# EAGLE schematic Sensors_to_mcu_v0.1 (EAGLE 9.5.2)
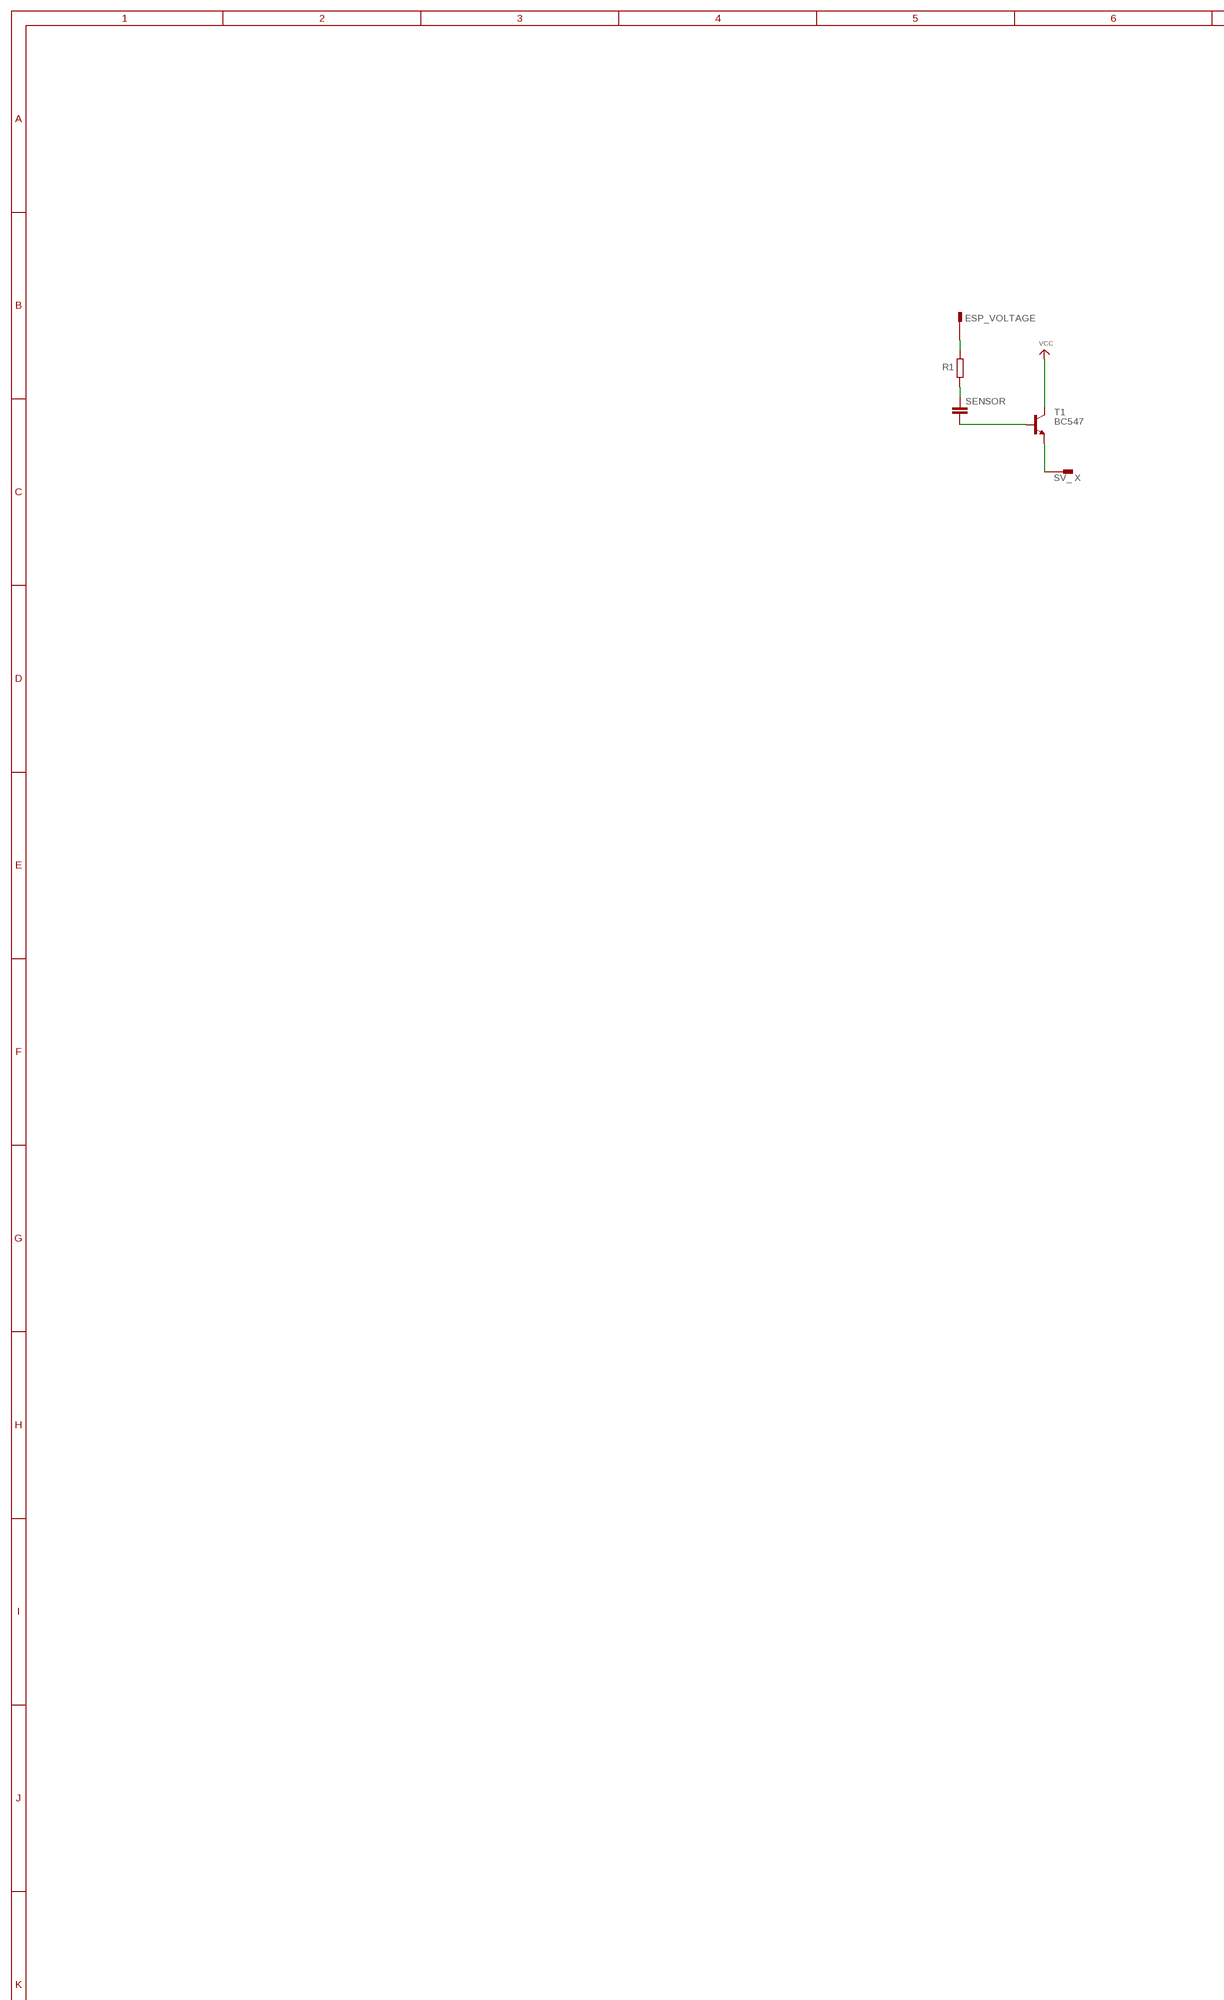
[diagram p0: schematic, sheet 1, part 1 of 3]
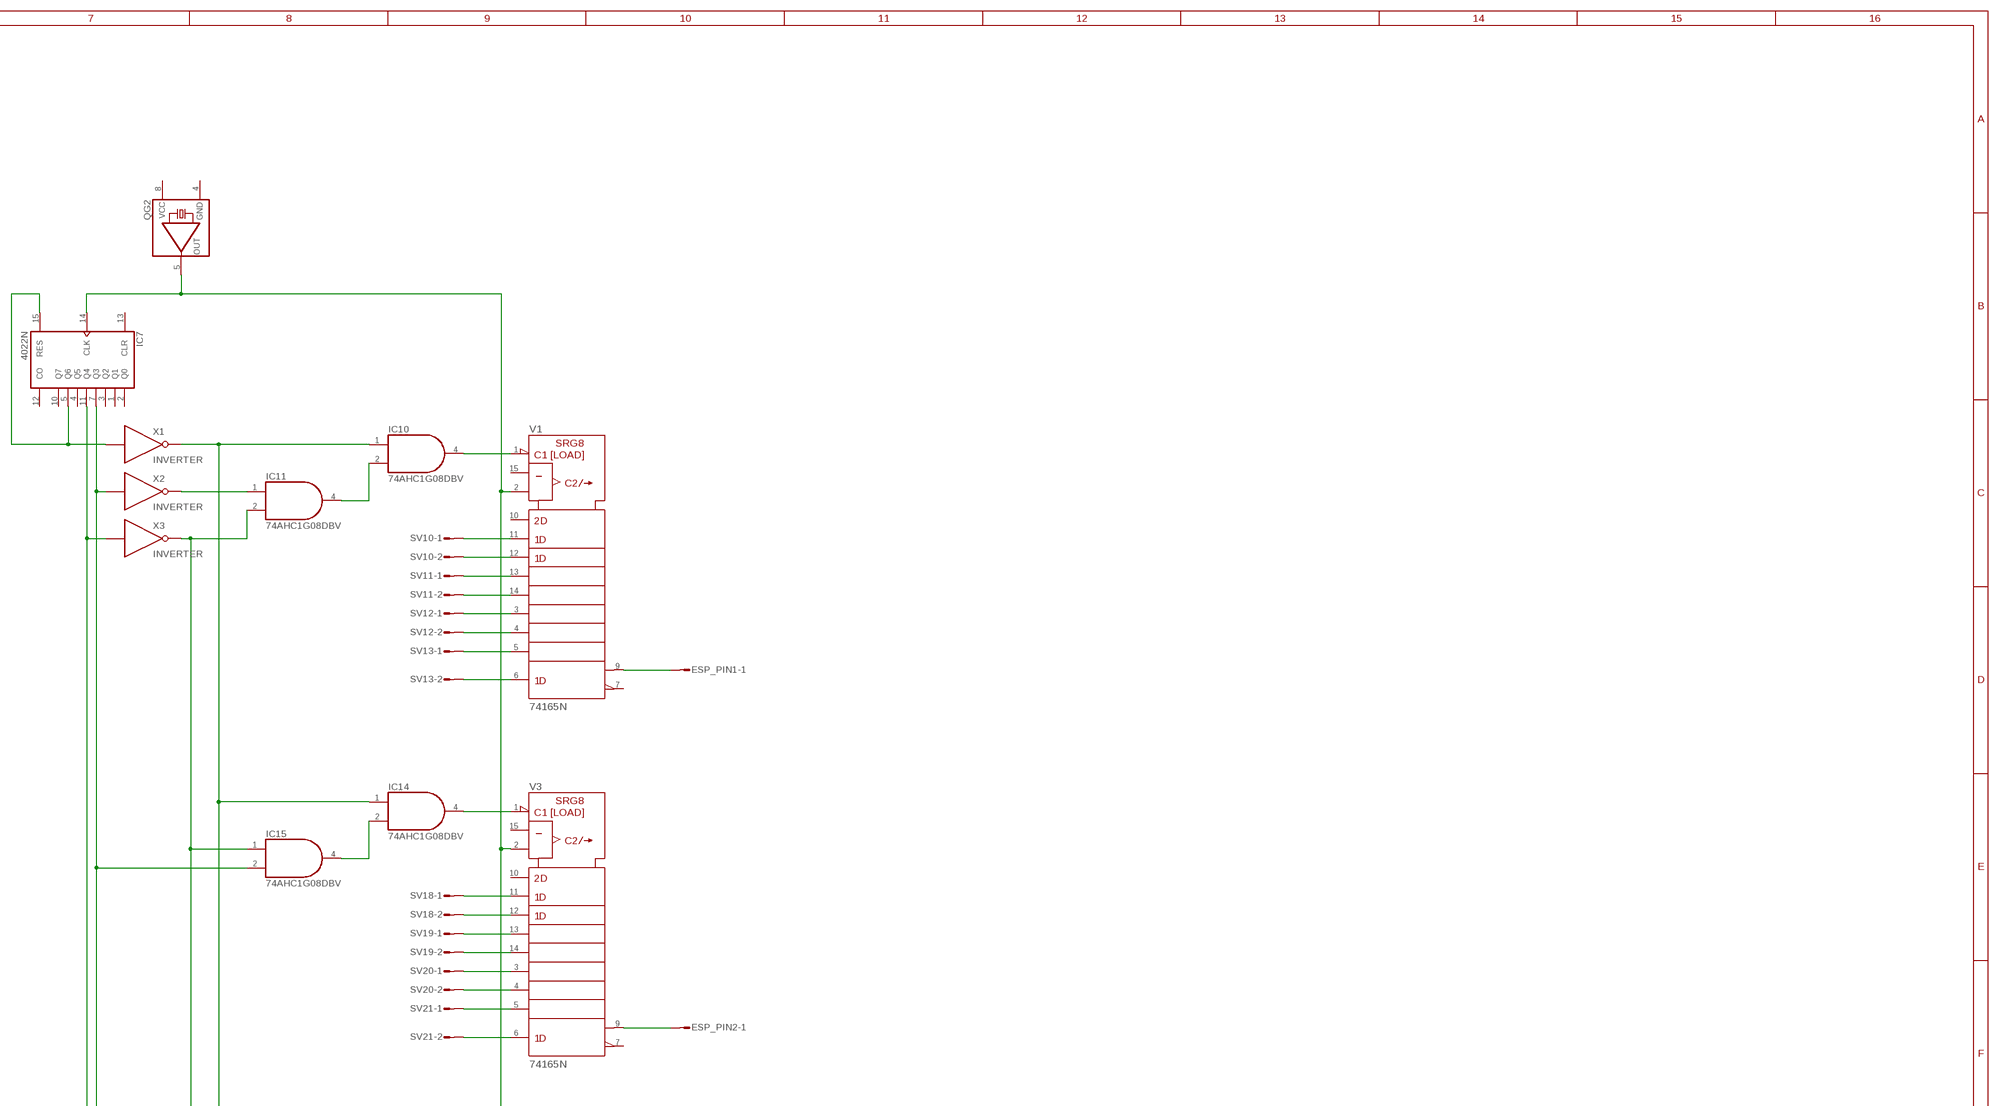
[diagram p1: schematic, sheet 1, part 2 of 3]
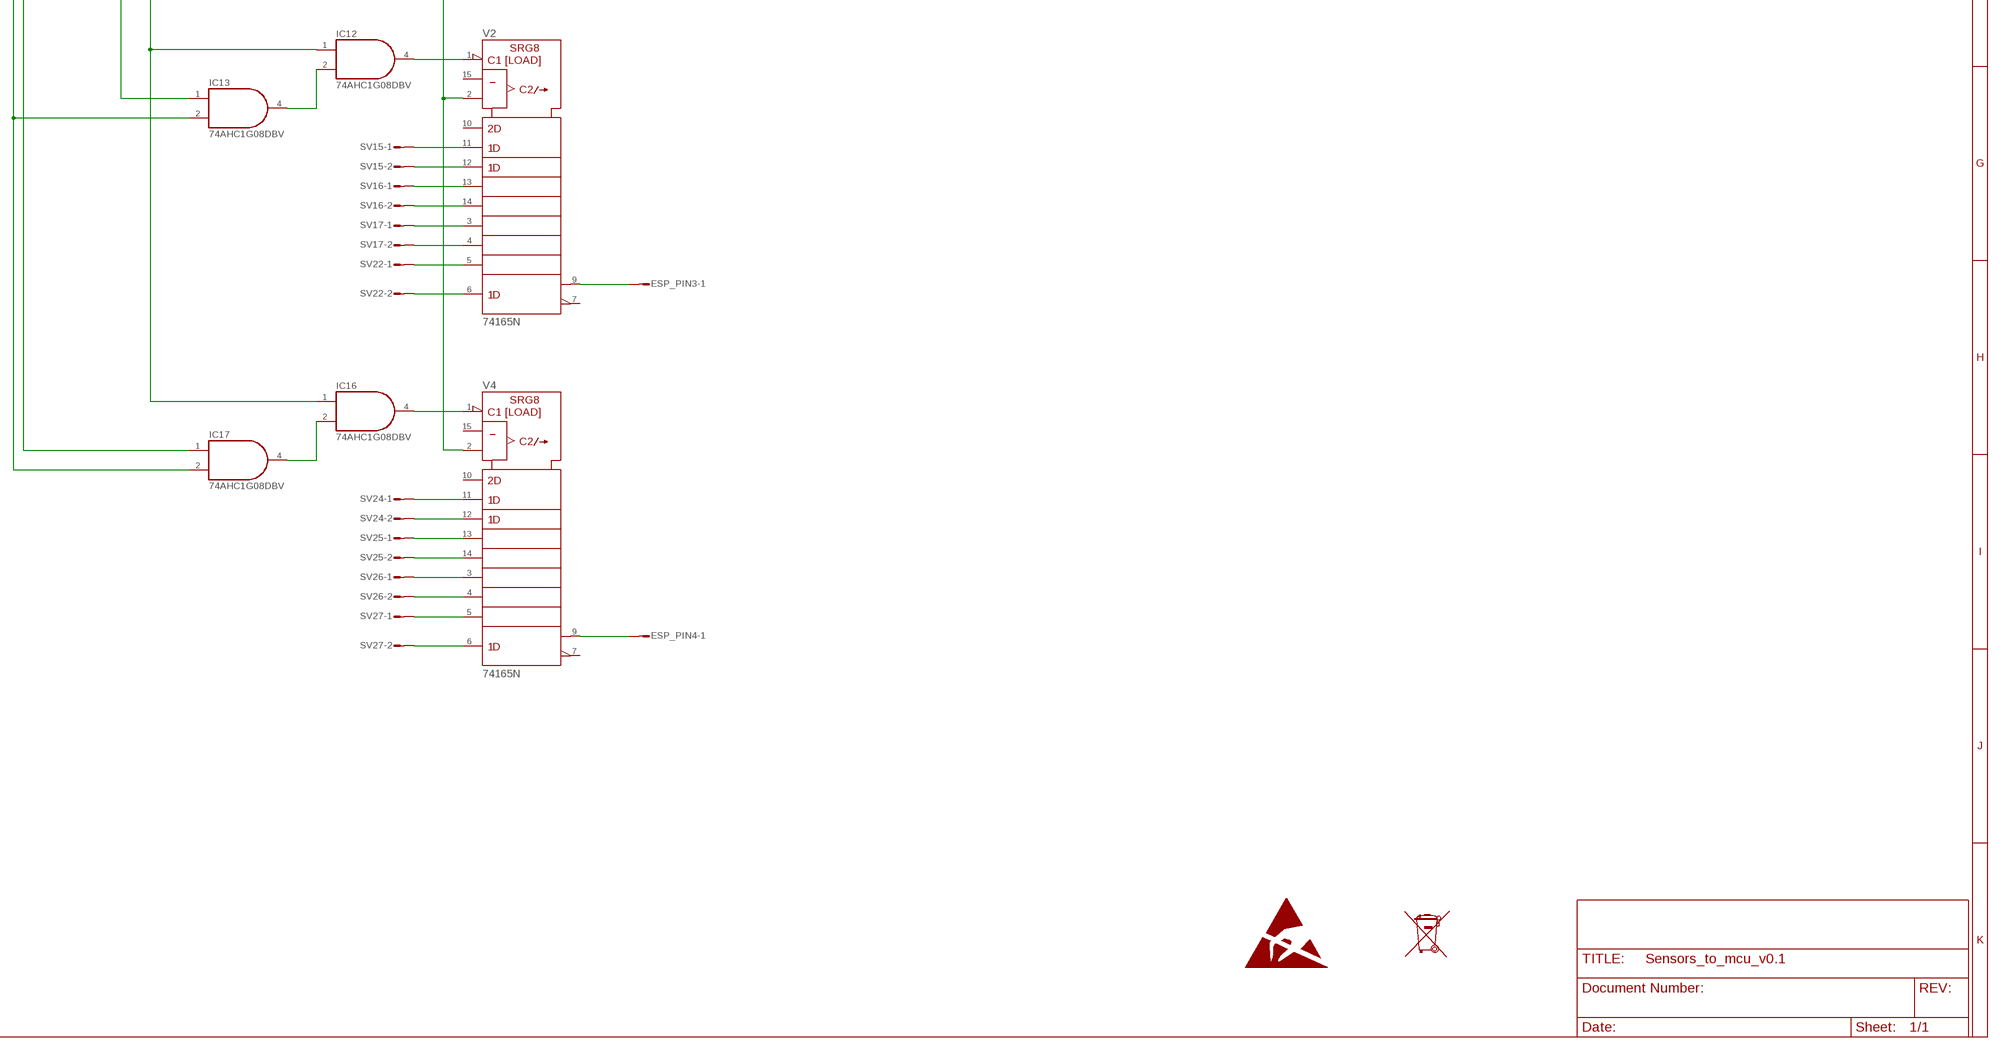
[diagram p2: schematic, sheet 1, part 3 of 3]

## Parts
ESP_PIN1  S02P  [S02P]
ESP_PIN2  S02P  [S02P]
ESP_PIN3  S02P  [S02P]
ESP_PIN4  S02P  [S02P]
ESP_VOLTAGE  PIN1-2  [62221]
IC7  4022N  [DIL16]
IC10  74AHC1G08DBV  [SOT23-5]
IC11  74AHC1G08DBV  [SOT23-5]
IC12  74AHC1G08DBV  [SOT23-5]
IC13  74AHC1G08DBV  [SOT23-5]
IC14  74AHC1G08DBV  [SOT23-5]
IC15  74AHC1G08DBV  [SOT23-5]
IC16  74AHC1G08DBV  [SOT23-5]
IC17  74AHC1G08DBV  [SOT23-5]
QG2  QG5460  [DIL08S]
R1  R-EU_0207/10  [0207/10]
SENSOR  C-EU025-025X050  [C025-025X050]
SENSOR_MEASUREMENT  SV_ X  PIN1-2  [62221]
SV10  S02P  [S02P]
SV11  S02P  [S02P]
SV12  S02P  [S02P]
SV13  S02P  [S02P]
SV15  S02P  [S02P]
SV16  S02P  [S02P]
SV17  S02P  [S02P]
SV18  S02P  [S02P]
SV19  S02P  [S02P]
SV20  S02P  [S02P]
SV21  S02P  [S02P]
SV22  S02P  [S02P]
SV24  S02P  [S02P]
SV25  S02P  [S02P]
SV26  S02P  [S02P]
SV27  S02P  [S02P]
T1  BC547  [TO92]
V1  74165N  [DIL16]
V2  74165N  [DIL16]
V3  74165N  [DIL16]
V4  74165N  [DIL16]
X1  INVERTER  (no package)
X2  INVERTER  (no package)
X3  INVERTER  (no package)

## Nets
N$1: R1.1 SENSOR.1
N$2: SENSOR.2 T1.2(B)
N$3: SENSOR_MEASUREMENT.1 T1.1(E)
N$4: ESP_VOLTAGE.1 R1.2
N$18: SV10.1 V1.11(A)
N$19: SV10.2 V1.12(B)
N$20: SV11.1 V1.13(C)
N$21: SV11.2 V1.14(D)
N$22: SV12.1 V1.3(E)
N$23: SV12.2 V1.4(F)
N$24: SV13.1 V1.5(G)
N$25: SV13.2 V1.6(H)
N$26: ESP_PIN1.1 V1.9(QH)
N$27: IC7.14(CLK) QG2.5(OUT) V1.2(CLK) V2.2(CLK) V3.2(CLK) V4.2(CLK)
N$28: SV18.1 V3.11(A)
N$29: IC11.2(I1) IC13.1(I0) IC15.1(I0) X3.O
N$30: IC7.7(Q3) IC15.2(I1) IC17.1(I0) X2.I
N$31: IC7.5(Q6) IC7.15(RES) X1.I
N$32: IC7.11(Q4) IC13.2(I1) IC17.2(I1) X3.I
N$33: IC11.1(I0) X2.O
N$34: IC10.1(I0) IC12.1(I0) IC14.1(I0) IC16.1(I0) X1.O
N$35: IC10.2(I1) IC11.4(O)
N$36: IC10.4(O) V1.1(SH/!LD)
N$37: SV18.2 V3.12(B)
N$38: SV19.1 V3.13(C)
N$39: SV19.2 V3.14(D)
N$40: SV20.1 V3.3(E)
N$41: SV20.2 V3.4(F)
N$42: SV21.1 V3.5(G)
N$43: SV15.1 V2.11(A)
N$44: SV15.2 V2.12(B)
N$45: SV21.2 V3.6(H)
N$46: ESP_PIN2.1 V3.9(QH)
N$48: SV16.1 V2.13(C)
N$49: IC14.2(I1) IC15.4(O)
N$50: IC14.4(O) V3.1(SH/!LD)
N$51: SV16.2 V2.14(D)
N$52: SV17.1 V2.3(E)
N$53: SV17.2 V2.4(F)
N$54: SV22.1 V2.5(G)
N$55: SV22.2 V2.6(H)
N$56: ESP_PIN3.1 V2.9(QH)
N$58: IC12.2(I1) IC13.4(O)
N$59: IC12.4(O) V2.1(SH/!LD)
N$60: SV24.1 V4.11(A)
N$61: SV24.2 V4.12(B)
N$62: SV25.1 V4.13(C)
N$63: SV25.2 V4.14(D)
N$64: SV26.1 V4.3(E)
N$65: SV26.2 V4.4(F)
N$66: SV27.1 V4.5(G)
N$67: SV27.2 V4.6(H)
N$68: ESP_PIN4.1 V4.9(QH)
N$70: IC16.2(I1) IC17.4(O)
N$71: IC16.4(O) V4.1(SH/!LD)
VCC: T1.3(C)
Unconnected: ESP_PIN1.2 ESP_PIN2.2 ESP_PIN3.2 ESP_PIN4.2 IC7.1(Q1) IC7.2(Q0) IC7.3(Q2) IC7.4(Q5) IC7.10(Q7) IC7.12(CO) IC7.13(CLR) V1.7(!QH) V1.10(SER) V1.15(CLK_INH) V2.7(!QH) V2.10(SER) V2.15(CLK_INH) V3.7(!QH) V3.10(SER) V3.15(CLK_INH) V4.7(!QH) V4.10(SER) V4.15(CLK_INH)

## Power pins joined to a net without a drawn wire
+UB: V1.16(+UB) V2.16(+UB) V3.16(+UB) V4.16(+UB)
-UB: V1.8(-UB) V2.8(-UB) V3.8(-UB) V4.8(-UB)
GND: IC10.3(GND) IC11.3(GND) IC12.3(GND) IC13.3(GND) IC14.3(GND) IC15.3(GND) IC16.3(GND) IC17.3(GND) QG2.4(GND)
VCC: IC10.5(VCC) IC11.5(VCC) IC12.5(VCC) IC13.5(VCC) IC14.5(VCC) IC15.5(VCC) IC16.5(VCC) IC17.5(VCC) QG2.8(VCC)
VDD: IC7.16(VDD)
VSS: IC7.8(VSS)

## Library data of the parts
ESP_PIN1-ESP_PIN4 SV10-SV13 SV15-SV22 SV24-SV27 = con-amp-mt:S02P: AMP MT CONNECTOR; OC_FARNELL: unknown; OC_NEWARK: unknown
ESP_VOLTAGE SENSOR_MEASUREMENT = con-faston:PIN1-2: CONN TAB FASTON BRASS .187 PCB TAB, FSSTON, DUAL STAKE, .187 SERIES Digi-Key Part Number: A24734CT-ND Source: Tyco Electronics Corporation .. ENG_CD_62221_R.pdf http://search.digikey.com/scripts/DkSearch/dksus.dll?Detail&name=A24734CT-ND; MF: TYCO ELECTRONICS; MPN: 62221-1; OC_FARNELL: unknown; OC_NEWARK: 16H2318
IC7 = 40xx:4022: Divide-by 8 COUNTER
IC10-IC17 = 74xx-little-us:74*1G08: 2-input AND gate
QG2 = crystal:QG5460: CRYSTAL RESONATOR; OC_FARNELL: unknown; OC_NEWARK: unknown
R1 = rcl:R-EU_: RESISTOR, European symbol; SPICEPREFIX: R
SENSOR = rcl:C-EU: CAPACITOR, European symbol; SPICEPREFIX: C
T1 = transistor:BC547: NPN TRANSISTOR
V1-V4 = 74ttl-din:74*165: 8-bit parallel load SHIFT REGISTER
X1-X3 = ngspice-digital:INVERTER: logic inverter (NOT gate)

## Module ETST
Ports: 

### Library data of the parts